# EAGLE design 6309 CPU Card v2 (EAGLE 4.16)
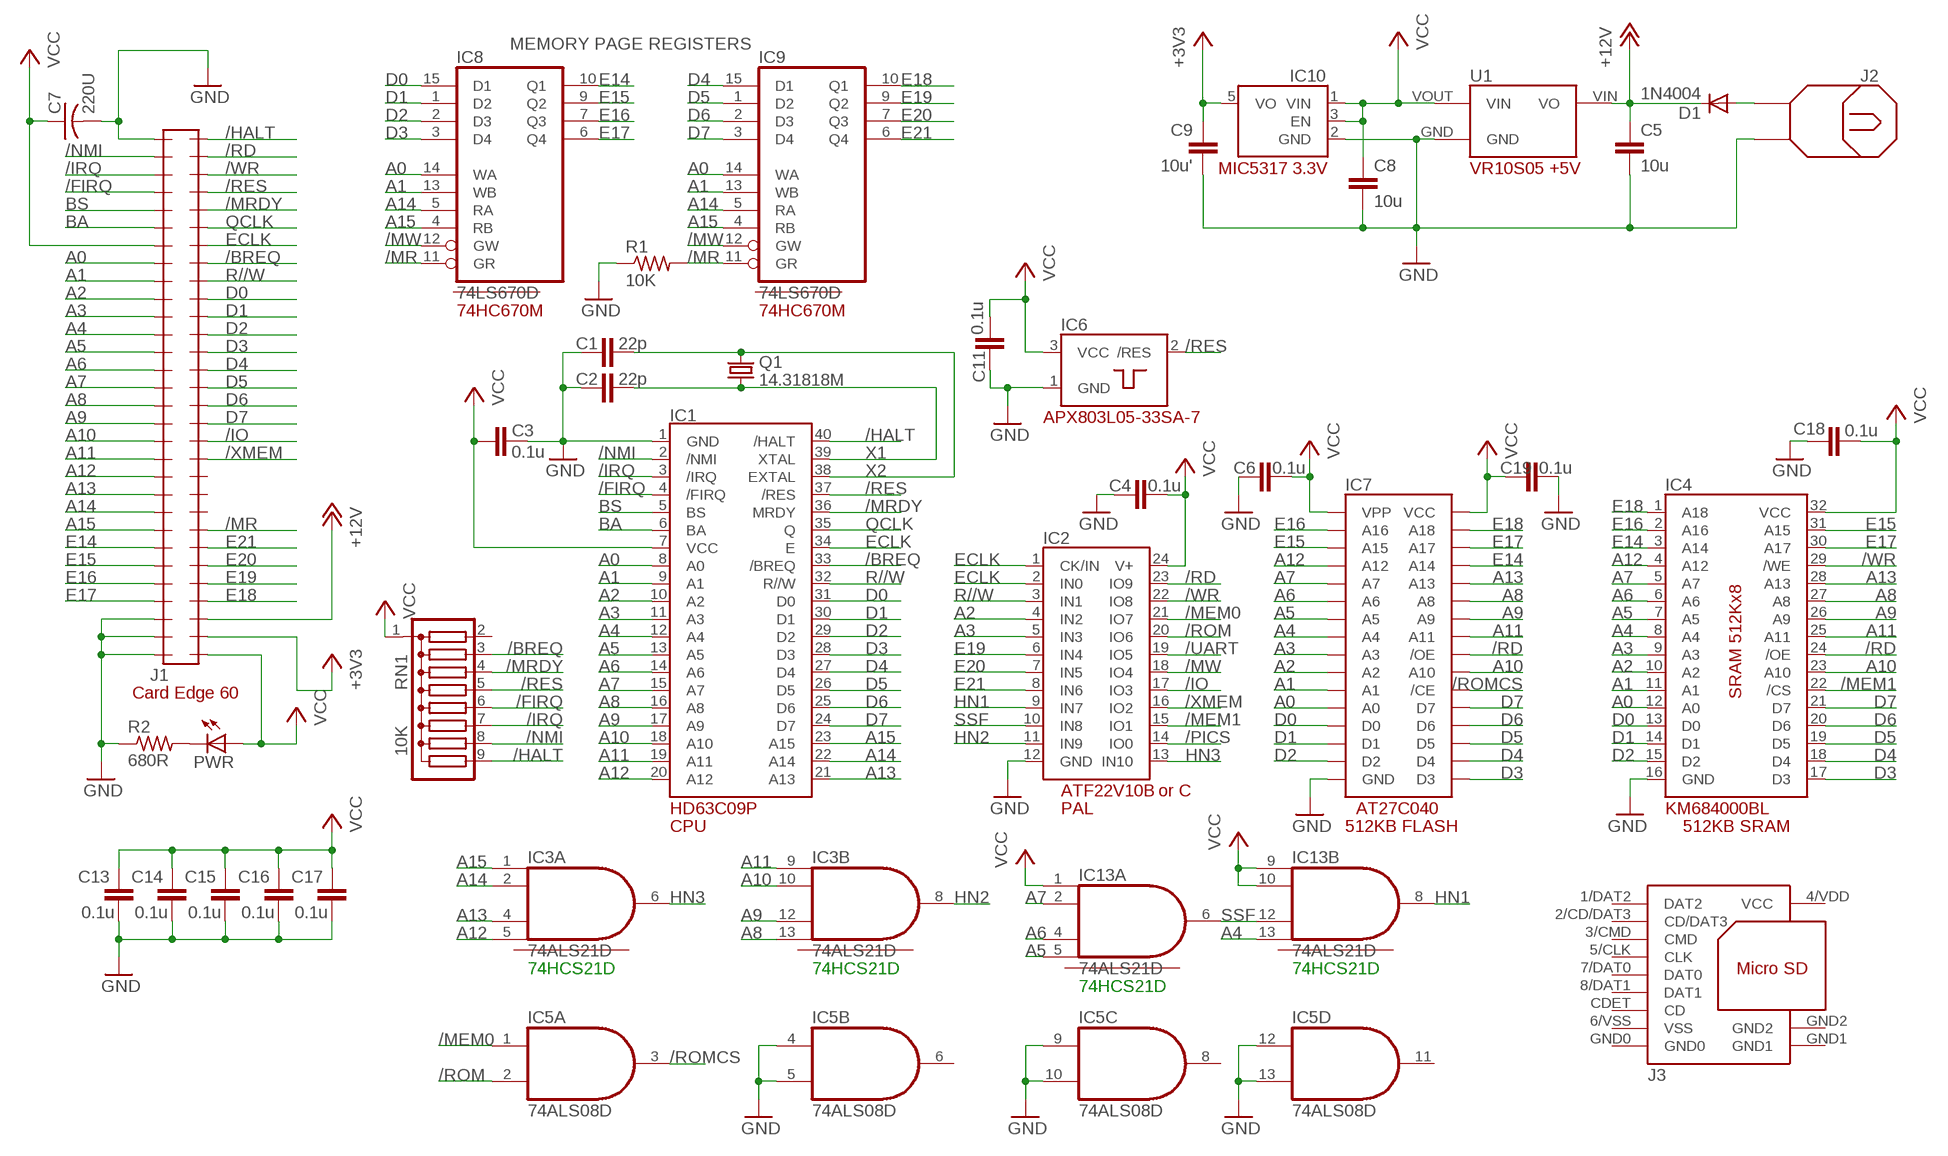
[diagram p0: schematic, sheet 1]

## Parts
C1  22p  C-EUC0603  [C0603]
C2  22p  C-EUC0603  [C0603]
C3  0.1u  C-EUC0603  [C0603]
C4  0.1u  C-EUC0603  [C0603]
C5  10u  C-EUC0805  [C0805]
C6  0.1u  C-EUC0603  [C0603]
C7  220U  C-US025-050X050  [C025-050X050]
C8  10u  C-EUC0805  [C0805]
C9  10u'  C-EUC0805  [C0805]
C11  0.1u  C-EUC0603  [C0603]
C13  0.1u  C-EUC0603  [C0603]
C14  0.1u  C-EUC0603  [C0603]
C15  0.1u  C-EUC0603  [C0603]
C16  0.1u  C-EUC0603  [C0603]
C17  0.1u  C-EUC0603  [C0603]
C18  0.1u  C-EUC0603  [C0603]
C19  0.1u  C-EUC0603  [C0603]
D1  1N4004  [DO41-10]
IC1  HD63C09P  [DIL40]
IC2  PLD_ATF22V10B  [DIL24-3]
IC3  74ALS21D  [SO14]
IC4  SRAM_512KX8_KM684000BL  [DIL32]
IC5  74ALS08D  [SO14]
IC6  POR_APX803L05-33SA-7  [SOT23]
IC7  FLASH_512KB_AT27C040  [DIL32]
IC8  74LS670D  [SO16]
IC9  74LS670D  [SO16]
IC10  MIC5317_3.3V  [SOT23-5]
IC13  74ALS21D  [SO14]
J1  CARDEDGE_2.54_60POS  CARDEDGE_2.54_60POSEDGE  [CARDEDGE_2.54_60POS]
J2  DC_BARREL_JACK  [DC_BARREL_JACK]
J3  MICROSD_AMPHENOL_GTFP084328  [MICROSD_AMPHENOL_GTFP08432B1HR]
PWR  LED3MM  [LED3MM]
Q1  14.31818M  CRYSTALHC49S  [HC49/S]
R1  10K  R-US_R0603  [R0603]
R2  680R  R-US_R0603  [R0603]
RN1  10K  G08R  [SIL9]
U1  VREG_5V_VR10S05  [VREG_5V_CP_POWER_VR10S05]

## Nets
+3V3 [supply]: C9.1 IC10.5(VO) J1.32
+12V [supply]: C5.1 D1.C J1.33 U1.VIN(VO)
/BREQ: IC1.33(/BREQ) J1.53 RN1.3
/FIRQ: IC1.4(/FIRQ) J1.4 RN1.6
/HALT: IC1.40(/HALT) J1.60 RN1.9
/IO: IC2.17(IO3) J1.43
/IRQ: IC1.3(/IRQ) J1.3 RN1.7
/MEM0: IC2.21(IO7) IC5.1(A:I0)
/MEM1: IC2.15(IO1) IC4.22(/CS)
/MR: IC8.11(GR) IC9.11(GR) J1.38 R1.2
/MRDY: IC1.36(MRDY) J1.56 RN1.4
/MW: IC2.18(IO4) IC8.12(GW) IC9.12(GW)
/NMI: IC1.2(/NMI) J1.2 RN1.8
/PICS: IC2.14(IO0)
/RD: IC2.23(IO9) IC4.24(/OE) IC7.24(/OE) J1.59
/RES: IC1.37(/RES) IC6.2(/RES) J1.57 RN1.5
/ROM: IC2.20(IO6) IC5.2(A:I1)
/ROMCS: IC5.3(A:O) IC7.22(/CE)
/UART: IC2.19(IO5)
/WR: IC2.22(IO8) IC4.29(/WE) J1.58
/XMEM: IC2.16(IO2) J1.42
A0: IC1.8(A0) IC4.12(A0) IC7.12(A0) IC8.14(WA) IC9.14(WA) J1.8
A1: IC1.9(A1) IC4.11(A1) IC7.11(A1) IC8.13(WB) IC9.13(WB) J1.9
A2: IC1.10(A2) IC2.4(IN2) IC4.10(A2) IC7.10(A2) J1.10
A3: IC1.11(A3) IC2.5(IN3) IC4.9(A3) IC7.9(A3) J1.11
A4: IC1.12(A4) IC4.8(A4) IC7.8(A4) IC13.13(B:I3) J1.12
A5: IC1.13(A5) IC4.7(A5) IC7.7(A5) IC13.5(A:I3) J1.13
A6: IC1.14(A6) IC4.6(A6) IC7.6(A6) IC13.4(A:I2) J1.14
A7: IC1.15(A7) IC4.5(A7) IC7.5(A7) IC13.2(A:I1) J1.15
A8: IC1.16(A8) IC3.13(B:I3) IC4.27(A8) IC7.27(A8) J1.16
A9: IC1.17(A9) IC3.12(B:I2) IC4.26(A9) IC7.26(A9) J1.17
A10: IC1.18(A10) IC3.10(B:I1) IC4.23(A10) IC7.23(A10) J1.18
A11: IC1.19(A11) IC3.9(B:I0) IC4.25(A11) IC7.25(A11) J1.19
A12: IC1.20(A12) IC3.5(A:I3) IC4.4(A12) IC7.4(A12) J1.20
A13: IC1.21(A13) IC3.4(A:I2) IC4.28(A13) IC7.28(A13) J1.21
A14: IC1.22(A14) IC3.2(A:I1) IC8.5(RA) IC9.5(RA) J1.22
A15: IC1.23(A15) IC3.1(A:I0) IC8.4(RB) IC9.4(RB) J1.23
BA: IC1.6(BA) J1.6
BS: IC1.5(BS) J1.5
D0: IC1.31(D0) IC4.13(D0) IC7.13(D0) IC8.15(D1) J1.51
D1: IC1.30(D1) IC4.14(D1) IC7.14(D1) IC8.1(D2) J1.50
D2: IC1.29(D2) IC4.15(D2) IC7.15(D2) IC8.2(D3) J1.49
D3: IC1.28(D3) IC4.17(D3) IC7.17(D3) IC8.3(D4) J1.48
D4: IC1.27(D4) IC4.18(D4) IC7.18(D4) IC9.15(D1) J1.47
D5: IC1.26(D5) IC4.19(D5) IC7.19(D5) IC9.1(D2) J1.46
D6: IC1.25(D6) IC4.20(D6) IC7.20(D6) IC9.2(D3) J1.45
D7: IC1.24(D7) IC4.21(D7) IC7.21(D7) IC9.3(D4) J1.44
E14: IC4.3(A14) IC7.29(A14) IC8.10(Q1) J1.24
E15: IC4.31(A15) IC7.3(A15) IC8.9(Q2) J1.25
E16: IC4.2(A16) IC7.2(A16) IC8.7(Q3) J1.26
E17: IC4.30(A17) IC7.30(A17) IC8.6(Q4) J1.27
E18: IC4.1(A18) IC7.31(A18) IC9.10(Q1) J1.34
E19: IC2.6(IN4) IC9.9(Q2) J1.35
E20: IC2.7(IN5) IC9.7(Q3) J1.36
E21: IC2.8(IN6) IC9.6(Q4) J1.37
ECLK: IC1.34(E) IC2.1(CK/IN) IC2.2(IN0) J1.54
GND [supply]: C1.1 C2.1 C3.2 C4.1 C5.2 C6.1 C7.2 C8.2 C9.2 C11.2 C13.2 C14.2 C15.2 C16.2 C17.2 C18.1 C19.2 IC1.1(GND) IC2.12(GND) IC4.16(GND) IC5.4(B:I0) IC5.5(B:I1) IC5.9(C:I0) IC5.10(C:I1) IC5.12(D:I0) IC5.13(D:I1) IC6.1(GND) IC7.16(GND) IC10.2(GND) J1.1 J1.28 J1.29 J1.30 J2.- R1.1 R2.1 U1.GND
HN1: IC2.9(IN7) IC13.8(B:O)
HN2: IC2.11(IN9) IC3.8(B:O)
HN3: IC2.13(IN10) IC3.6(A:O)
N$1 [supply]: D1.A J2.+
N$2: PWR.K(C) R2.2
QCLK: IC1.35(Q) J1.55
R//W: IC1.32(R//W) IC2.3(IN1) J1.52
SSF: IC2.10(IN8) IC13.6(A:O) IC13.12(B:I2)
VCC [supply]: C3.1 C4.2 C6.2 C7.1 C8.1 C11.1 C13.1 C14.1 C15.1 C16.1 C17.1 C18.2 C19.1 IC1.7(VCC) IC2.24(V+) IC4.32(VCC) IC6.3(VCC) IC7.1(VPP) IC7.32(VCC) IC10.1(VIN) IC10.3(EN) IC13.1(A:I0) IC13.9(B:I0) IC13.10(B:I1) J1.7 J1.31 PWR.A RN1.1 U1.VOUT(VIN)
X1: C2.2 IC1.39(XTAL) Q1.1
X2: C1.2 IC1.38(EXTAL) Q1.2
Unconnected: IC5.6(B:O) IC5.8(C:O) IC5.11(D:O) J1.39 J1.40 J1.41 J3.1/DAT2(DAT2) J3.2/CD/DAT3(CD/DAT3) J3.3/CMD(CMD) J3.4/VDD(VCC) J3.5/CLK(CLK) J3.6/VSS(VSS) J3.7/DAT0(DAT0) J3.8/DAT1(DAT1) J3.CDET(CD) J3.GND0 J3.GND1 J3.GND2 RN1.2

## Notes on the sheet
- MEMORY PAGE REGISTERS
- 74HC670M | 74HC670M
- or C
- PAL
- CPU | 512KB FLASH | 512KB SRAM
- 74HCS21D | 74HCS21D | 74HCS21D
- 74HCS21D

## Power pins joined to a net without a drawn wire
GND: IC3.7(P:GND) IC5.7(P:GND) IC8.8(GND) IC9.8(GND) IC13.7(P:GND)
VCC: IC3.14(P:VCC) IC5.14(P:VCC) IC8.16(VCC) IC9.16(VCC) IC13.14(P:VCC)

## Library data of the parts
C1-C6 C8 C9 C11 C13-C19 = rcl:C-EU: CAPACITOR, European symbol
C7 = rcl:C-US: CAPACITOR, American symbol
D1 = diode:1N4004: DIODE general purpose rectifier, 1 A
IC1 = 07-Retrocomputing:HD63C09P
IC2 = 07-Retrocomputing:PLD_ATF22V10B
IC3 IC13 = 74xx-us:74*21: Dual 4-input AND gate
IC4 = 07-Retrocomputing:SRAM_512KX8_KM684000BL
IC5 = 74xx-us:74*08: Quad 2-input AND gate
IC6 = 07-Retrocomputing:POR_APX803L05-33SA-7
IC7 = 07-Retrocomputing:FLASH_512KB_AT27C040
IC8 IC9 = 74xx-us:74*670: 4 by 4 REGISTER FILES, 3-state
IC10 = 07-Retrocomputing:MIC5317_3.3V
J1 = 07-Retrocomputing:CARDEDGE_2.54_60POS
J2 = 01-hacker-daw:DC_BARREL_JACK
J3 = 07-Retrocomputing:MICROSD_AMPHENOL_GTFP084328
PWR = led:LED: LED OSRAM: - CHIPLED LG R971, LG N971, LY N971, LG Q971, LY Q971, LO R971, LY R971 LH N974, LH R974 LS Q976, LO Q976, LY Q976 LO Q996 - Hyper CHIPLED LW Q18S LB Q993, LB Q99A, LB R99A - SideLED LS A670, LO A670, LY A670, LG A670, LP A670 LB A673, LV A673, LT A673, LW A673 LH A674 LY A675 LS A676, LA A676, LO A676, LY A676, LW A676 LS A679, LY A679, LG A679 - Hyper Micro SIDELED® LS Y876, LA Y876, LO Y876, LY Y876 LT Y87S - SmartLED LW L88C, LW L88S LB L89C, LB L89S, LG L890 LS L89K, LO L89K, LY L89K LS L896, LA L896, LO L896, LY L896 - TOPLED LS T670, LO T670, LY T670, LG T670, LP T670 LSG T670, LSP T670, LSY T670, LOP T670, LYG T670 LG T671, LOG T671, LSG T671 LB T673, LV T673, LT T673, LW T673 LH T674 LS T676, LA T676, LO T676, LY T676, LB T676, LH T676, LSB T676, LW T676 LB T67C, LV T67C, LT T67C, LS T67K, LO T67K, LY T67K, LW E67C LS E67B, LA E67B, LO E67B, LY E67B, LB E67C, LV E67C, LT E67C LW T67C LS T679, LY T679, LG T679 LS T770, LO T770, LY T770, LG T770, LP T770 LB T773, LV T773, LT T773, LW T773 LH T774 LS E675, LA E675, LY E675, LS T675 LS T776, LA T776, LO T776, LY T776, LB T776 LHGB T686 LT T68C, LB T68C - Hyper Mini TOPLED® LB M676 - Mini TOPLED Santana® LG M470 LS M47K, LO M47K, LY M47K Source: http://www.osram.convergy.de - LUMILED® LXK2-PW12-R00, LXK2-PW12-S00, LXK2-PW14-U00, LXK2-PW14-V00 LXK2-PM12-R00, LXK2-PM12-S00, LXK2-PM14-U00 LXK2-PE12-Q00, LXK2-PE12-R00, LXK2-PE12-S00, LXK2-PE14-T00, LXK2-PE14-U00 LXK2-PB12-K00, LXK2-PB12-L00, LXK2-PB12-M00, LXK2-PB14-N00, LXK2-PB14-P00, LXK2-PB14-Q00 LXK2-PR12-L00, LXK2-PR12-M00, LXK2-PR14-Q00, LXK2-PR14-R00 LXK2-PD12-Q00, LXK2-PD12-R00, LXK2-PD12-S00 LXK2-PH12-R00, LXK2-PH12-S00 LXK2-PL12-P00, LXK2-PL12-Q00, LXK2-PL12-R00 Source: www.luxeon.com
Q1 = crystal:CRYSTAL: CRYSTAL
R1 R2 = rcl:R-US_: RESISTOR, American symbol
RN1 = resistor-sil:G08R: SIL RESISTOR
U1 = 07-Retrocomputing:VREG_5V_VR10S05

## Net classes
0 default: width 0.203 mm, drill 0.203 mm, clearance 0.254 mm
1 supply: width 0.61 mm, drill 0.203 mm, clearance 0.305 mm

## Board
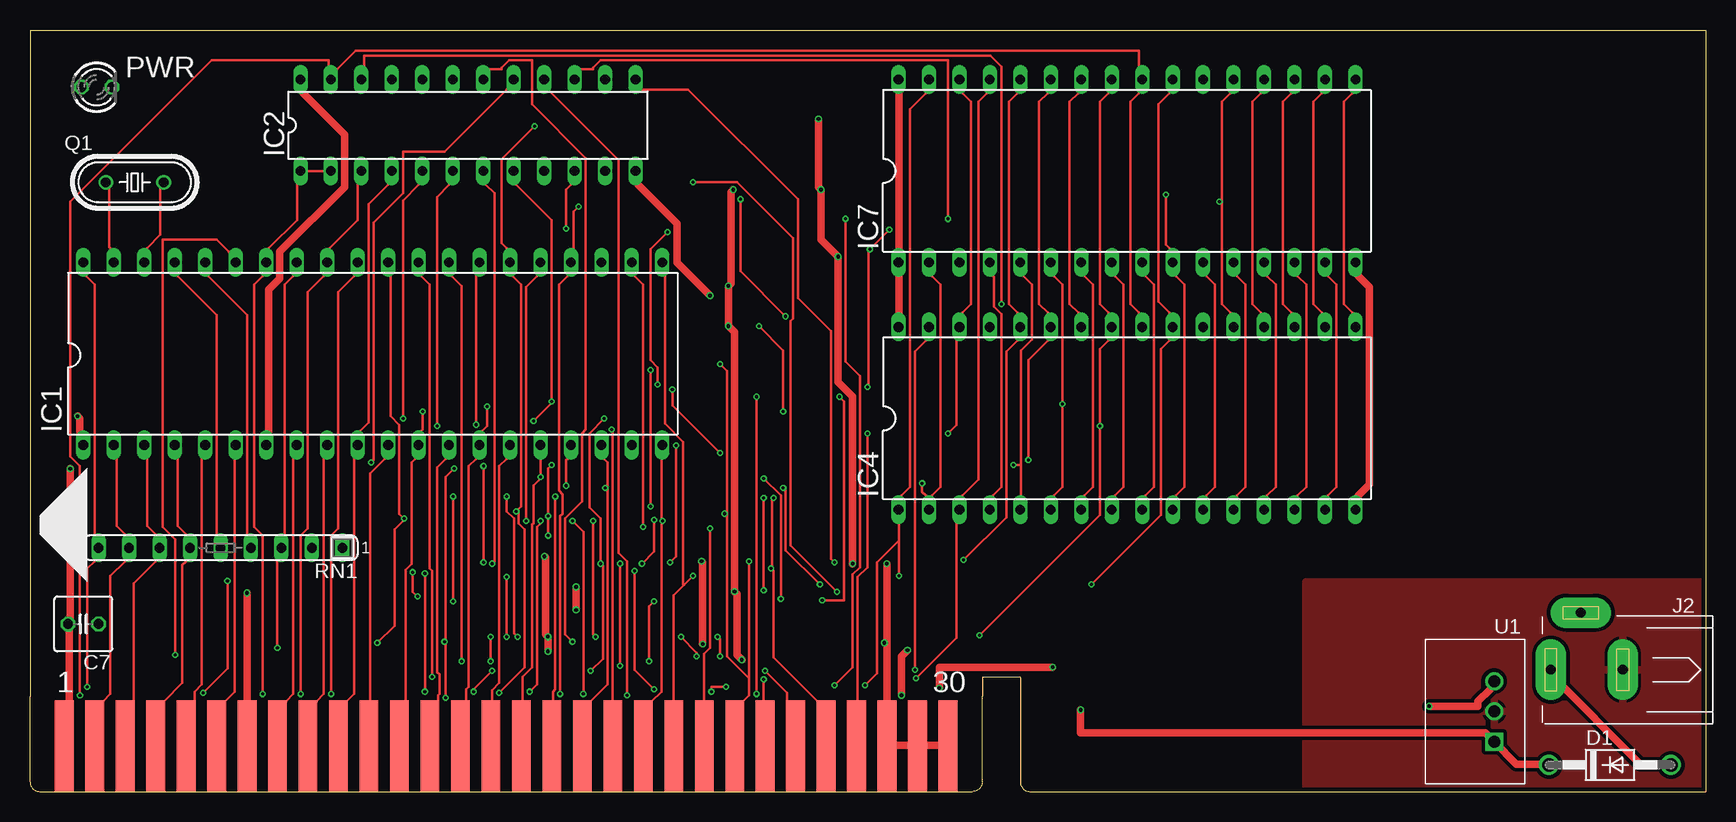
[diagram p1: board, top side]
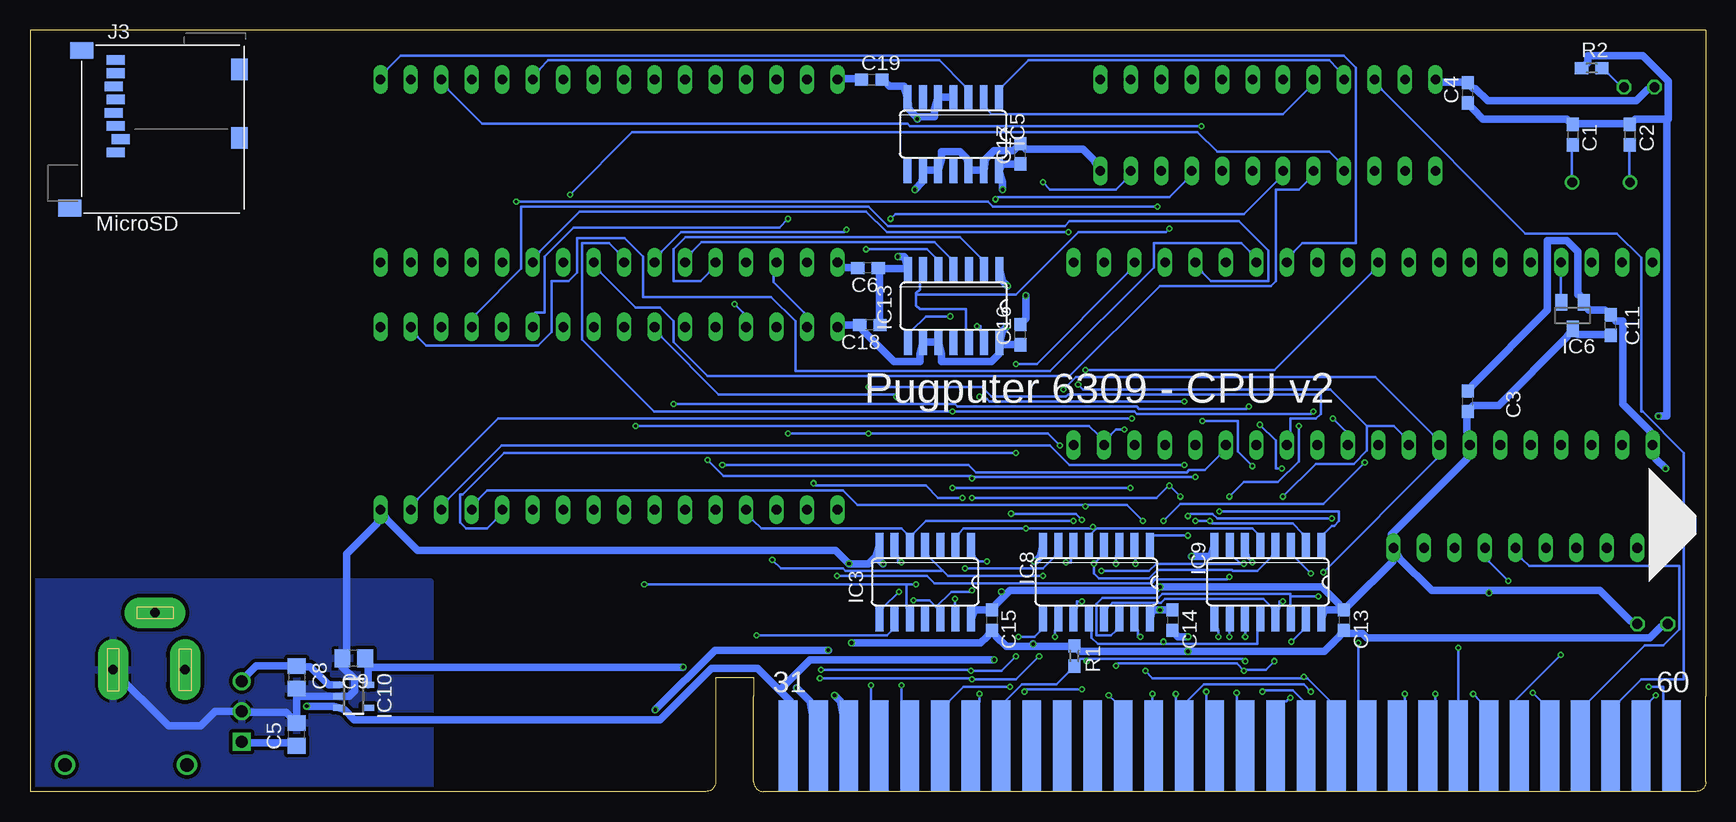
[diagram p2: board, bottom side, seen from below]

Size 139.7 x 63.5 mm. Coordinates in mm from the lower left corner, seen from the top.
Outline: 0,7.94 0,63.5 139.7,63.5 139.7,0 83.34,0 arc-90 82.55,0.79 82.55,9.53 79.38,9.53 79.38,7.94
Copper layers (1*16): Top 0.0356mm / dielectric 1.6mm / Bottom 0.0356mm
Design rules "oshpark-2layer": minimum track width 6mil, minimum drill 10mil, track to track 6mil, track to pad 6mil, pad to pad 6mil, via to via 6mil, smd to smd 6mil, copper to edge 15mil, drill to drill 6mil, minimum pad ring 5mil, minimum via ring 5mil, stop-mask expansion 2.5mil, vias tented up to drill 0mil, thermal gap 10mil

### Footprints (pad centres in the part's own frame; a part is rotated, then mirrored left to right if it is on the bottom)
C0603 = smd 1.1 x 1: 1 -0.85,0; 2 0.85,0
C0805 = smd 1.3 x 1.5: 1 -0.95,0; 2 0.95,0
C025-050X050 = drill 0.813 octagon: 1 -1.27,0; 2 1.27,0
DO41-10 = drill 1.118 round: A 5.08,0; C -5.08,0
DIL40 = drill 0.813 long: 1 -24.13,-7.62; 2 -21.59,-7.62; 3 -19.05,-7.62; 4 -16.51,-7.62; 5 -13.97,-7.62; 6 -11.43,-7.62; 7 -8.89,-7.62; 8 -6.35,-7.62; 9 -3.81,-7.62; 10 -1.27,-7.62; 11 1.27,-7.62; 12 3.81,-7.62; 13 6.35,-7.62; 14 8.89,-7.62; 15 11.43,-7.62; 16 13.97,-7.62; 17 16.51,-7.62; 18 19.05,-7.62; 19 21.59,-7.62; 20 24.13,-7.62; 21 24.13,7.62; 22 21.59,7.62; 23 19.05,7.62; 24 16.51,7.62; 25 13.97,7.62; 26 11.43,7.62; 27 8.89,7.62; 28 6.35,7.62; 29 3.81,7.62; 30 1.27,7.62; 31 -1.27,7.62; 32 -3.81,7.62; 33 -6.35,7.62; 34 -8.89,7.62; 35 -11.43,7.62; 36 -13.97,7.62; 37 -16.51,7.62; 38 -19.05,7.62; 39 -21.59,7.62; 40 -24.13,7.62
DIL24-3 = drill 0.813 long: 1 -13.97,-3.81; 2 -11.43,-3.81; 3 -8.89,-3.81; 4 -6.35,-3.81; 5 -3.81,-3.81; 6 -1.27,-3.81; 7 1.27,-3.81; 8 3.81,-3.81; 9 6.35,-3.81; 10 8.89,-3.81; 11 11.43,-3.81; 12 13.97,-3.81; 13 13.97,3.81; 14 11.43,3.81; 15 8.89,3.81; 16 6.35,3.81; 17 3.81,3.81; 18 1.27,3.81; 19 -1.27,3.81; 20 -3.81,3.81; 21 -6.35,3.81; 22 -8.89,3.81; 23 -11.43,3.81; 24 -13.97,3.81
SO14 = smd 0.66 x 2.032: 1 -3.81,-3.073; 2 -2.54,-3.073; 3 -1.27,-3.073; 4 0,-3.073; 5 1.27,-3.073; 6 2.54,-3.073; 7 3.81,-3.073; 8 3.81,3.073; 9 2.54,3.073; 10 1.27,3.073; 11 0,3.073; 12 -1.27,3.073; 13 -2.54,3.073; 14 -3.81,3.073
DIL32 = drill 0.813 long: 1 -19.05,-7.62; 2 -16.51,-7.62; 3 -13.97,-7.62; 4 -11.43,-7.62; 5 -8.89,-7.62; 6 -6.35,-7.62; 7 -3.81,-7.62; 8 -1.27,-7.62; 9 1.27,-7.62; 10 3.81,-7.62; 11 6.35,-7.62; 12 8.89,-7.62; 13 11.43,-7.62; 14 13.97,-7.62; 15 16.51,-7.62; 16 19.05,-7.62; 17 19.05,7.62; 18 16.51,7.62; 19 13.97,7.62; 20 11.43,7.62; 21 8.89,7.62; 22 6.35,7.62; 23 3.81,7.62; 24 1.27,7.62; 25 -1.27,7.62; 26 -3.81,7.62; 27 -6.35,7.62; 28 -8.89,7.62; 29 -11.43,7.62; 30 -13.97,7.62; 31 -16.51,7.62; 32 -19.05,7.62
SOT23 = smd 1 x 1.4: 1 -0.95,-1.1; 2 0.95,-1.1; 3 0,1.1
SO16 = smd 0.66 x 2.032: 1 -4.445,-3.073; 2 -3.175,-3.073; 3 -1.905,-3.073; 4 -0.635,-3.073; 5 0.635,-3.073; 6 1.905,-3.073; 7 3.175,-3.073; 8 4.445,-3.073; 9 4.445,3.073; 10 3.175,3.073; 11 1.905,3.073; 12 0.635,3.073; 13 -0.635,3.073; 14 -1.905,3.073; 15 -3.175,3.073; 16 -4.445,3.073
SOT23-5 = smd 0.5 x 1: 1 -0.95,-1.2; 2 0,-1.2; 3 0.95,-1.2; 4 0.95,1.2; 5 -0.95,1.2
CARDEDGE_2.54_60POS = smd 1.556 x 7.62: 1 -36.83,3.81; 2 -34.29,3.81; 3 -31.75,3.81; 4 -29.21,3.81; 5 -26.67,3.81; 6 -24.13,3.81; 7 -21.59,3.81; 8 -19.05,3.81; 9 -16.51,3.81; 10 -13.97,3.81; 11 -11.43,3.81; 12 -8.89,3.81; 13 -6.35,3.81; 14 -3.81,3.81; 15 -1.27,3.81; 16 1.27,3.81; 17 3.81,3.81; 18 6.35,3.81; 19 8.89,3.81; 20 11.43,3.81; 21 13.97,3.81; 22 16.51,3.81; 23 19.05,3.81; 24 21.59,3.81; 25 24.13,3.81; 26 26.67,3.81; 27 29.21,3.81; 28 31.75,3.81; 29 34.29,3.81; 30 36.83,3.81 | smd 1.556 x 7.62 bottom: 31 36.83,3.81; 32 34.29,3.81; 33 31.75,3.81; 34 29.21,3.81; 35 26.67,3.81; 36 24.13,3.81; 37 21.59,3.81; 38 19.05,3.81; 39 16.51,3.81; 40 13.97,3.81; 41 11.43,3.81; 42 8.89,3.81; 43 6.35,3.81; 44 3.81,3.81; 45 1.27,3.81; 46 -1.27,3.81; 47 -3.81,3.81; 48 -6.35,3.81; 49 -8.89,3.81; 50 -11.43,3.81; 51 -13.97,3.81; 52 -16.51,3.81; 53 -19.05,3.81; 54 -21.59,3.81; 55 -24.13,3.81; 56 -26.67,3.81; 57 -29.21,3.81; 58 -31.75,3.81; 59 -34.29,3.81; 60 -36.83,3.81
DC_BARREL_JACK = drill 0.8 pad 2.54 long: + 13.5,0; - 7.5,0; SW 11,-4.75
MICROSD_AMPHENOL_GTFP08432B1HR = smd 0.8 x 1.5: 1/DAT2 1.95,-10.3; 2/CD/DAT3 0.85,-9.9; 3/CMD -0.25,-10.3; 4/VDD -1.35,-10.5; 5/CLK -2.45,-10.3; 6/VSS -3.55,-10.5; 7/DAT0 -4.65,-10.3; 8/DAT1 -5.75,-10.3 | smd 1.8 x 1.4: CDET -4.95,0; GND0 0.75,0 | smd 1.4 x 1.9: GND1 -6.55,-13.15; GND2 6.6,-14.15
LED3MM = drill 0.813 octagon: A -1.27,0; K 1.27,0
HC49/S = drill 0.813 round: 1 -2.413,0; 2 2.413,0
R0603 = smd 1.1 x 1: 1 -0.85,0; 2 0.85,0
SIL9 = drill 0.813 long: 1 -10.16,0; 2 -7.62,0; 3 -5.08,0; 4 -2.54,0; 5 0,0; 6 2.54,0; 7 5.08,0; 8 7.62,0; 9 10.16,0
VREG_5V_CP_POWER_VR10S05 = drill 1 round: GND 0,0; VOUT 2.54,0 | drill 1 square: VIN -2.54,0

### Placement (x,y rotation side)
C1  11.11,54.77 270 bottom
C2  6.35,54.77 270 bottom
C3  19.84,32.54 90 bottom
C4  19.84,58.26 90 bottom
C5  117.47,4.76 90 bottom
C6  69.85,43.66 180 bottom
C7  4.45,13.97 180 top
C8  117.47,9.53 270 bottom
C9  112.71,11.11 180 bottom
C11  7.94,38.89 90 bottom
C13  30.16,14.29 270 bottom
C14  44.45,14.29 270 bottom
C15  59.53,14.29 270 bottom
C16  57.15,38.1 90 bottom
C17  57.15,53.18 90 bottom
C18  69.69,38.89 180 bottom
C19  69.53,59.37 0 bottom
D1  131.7,2.22 0 top
IC1  28.57,36.51 0 top
IC2  36.51,55.56 0 top
IC3  65.09,17.46 180 bottom
IC4  91.44,31.11 0 top
IC5  62.74,54.8 180 bottom
IC6  11.11,39.69 180 bottom
IC7  91.44,51.75 0 top
IC8  50.8,17.46 180 bottom
IC9  36.51,17.46 180 bottom
IC10  112.71,7.94 270 bottom
IC13  62.71,40.48 180 bottom
J1  39.69,0 0 top
J2  140.27,10.16 180 top
J3  122.24,55.24 270 bottom
PWR  5.56,58.74 0 top
Q1  8.73,50.8 0 top
R1  52.64,11.3 270 bottom
R2  9.53,60.33 0 bottom
RN1  15.88,20.32 180 top
U1  122.05,6.67 90 top

### Tracks (layer width: path | path; a pad name or v marks a point on that pad's centre or on a via)
+3V3  (via drill 0.3)
  Top 0.61: v85.24,10.36 75.79,10.36 v75.79,8.64
  Bottom 0.61: IC10.5 111.51,11.04 111.51,11.05 111.57,11.11 C9.1 111.15,10.36 v85.24,10.36 | v75.79,8.64 74.68,7.52 J1.32
+12V  (via drill 0.3)
  Top 0.61: D1.C 126.62,2.29 123.89,2.29 U1.VIN 121.31,4.88 87.58,4.88 v87.58,6.81 | v73.15,11.79 72.64,11.28 v72.64,8.03
  Bottom 0.61: U1.VIN 122.05,4.06 117.73,4.06 C5.1 | v87.58,6.81 82.6,11.79 v73.15,11.79 | v72.64,8.03 72.14,7.52 J1.33
/BREQ  (via drill 0.25)
  Top 0.203: IC1.33 21.95,42.98 21.23,42.27 21.23,21.44 RN1.3 20.62,19.2 v20.62,11.99
  Bottom 0.203: v20.62,11.99 20.62,7.52 J1.53
/FIRQ
  Top 0.203: IC1.4 12.29,27.74 12.29,22.15 13.01,21.44 RN1.6 13.01,19.2 12.7,18.9 12.7,9.04 11.18,7.52 J1.4
/HALT  (via drill 0.25)
  Top 0.203: IC1.40 4.67,42.98 5.38,42.27 5.38,21.44 RN1.9 5.38,19.2 4.78,18.59 v4.78,8.74
  Bottom 0.203: v4.78,8.74 3.56,8.74 3.56,7.52 J1.60
/IO  (via drill 0.25)
  Top 0.203: v28.45,27.43 28.65,27.64 28.65,47.45 31.09,49.89 31.09,53.34 34.54,53.34 39.73,58.52 IC2.17 | v45.21,22.55 46.13,21.64 v46.13,8.13
  Bottom 0.203: v28.45,27.43 31.9,23.98 43.79,23.98 v45.21,22.55 | v46.13,8.13 46.13,7.52 J1.43
/IRQ
  Top 0.203: IC1.3 9.75,27.74 9.75,22.15 10.46,21.44 RN1.7 10.46,19.2 8.64,17.37 8.64,7.52 J1.3
/MEM0
  Bottom 0.203: IC5.1 58.62,58.83 56.49,60.96 31.39,60.96 30.68,60.25 IC2.21
/MEM1  (via drill 0.25)
  Top 0.203: v76.5,47.75 76.5,60.96 47.55,60.96 46.94,60.35 46.94,60.25 45.92,60.25 IC2.15
  Bottom 0.203: v76.5,47.75 77.22,47.04 94.39,47.04 96.83,44.6 96.83,39.93 97.54,39.93 IC4.22
/MR  (via drill 0.25)
  Top 0.203: v38.41,10.87 v38.41,12.9 | v52.02,15.85 51.61,15.44 v51.61,10.87
  Bottom 0.203: J1.38 58.42,7.52 57,8.94 54.15,8.94 53.14,9.96 R1.2 52.22,10.97 52.12,11.07 51.61,11.07 | v38.41,12.9 38.41,13.41 IC9.11 | v38.41,10.87 38.61,11.07 51.61,11.07 | v52.02,15.85 52.43,15.85 52.43,15.34 IC8.11 | 51.61,11.07 v51.61,10.87
/MRDY  (via drill 0.25)
  Top 0.203: IC1.36 14.83,42.98 18.09,39.73 18.09,21.44 RN1.4 | v14.43,8.23 16.46,10.26 v16.46,17.58
  Bottom 0.203: v14.43,8.23 13.72,7.52 J1.56 | v16.46,17.58 18.09,19.2 RN1.4
/MW  (via drill 0.25)
  Top 0.203: v45.21,12.5 44.6,13.11 44.6,22.76 46.02,24.18 46.02,29.87 46.33,30.18 46.33,52.83 41.86,57.3 41.86,60.96 39.93,60.96 39.32,60.35 39.32,60.25 38.3,60.25 IC2.18
  Bottom 0.203: 45.21,12.29 50.7,12.29 51.21,12.8 51.21,13.41 IC8.12 | 45.21,12.29 37.39,12.29 37.39,13.41 IC9.12 | 45.21,12.29 v45.21,12.5
/NMI
  Top 0.203: IC1.2 7.21,27.74 7.21,22.15 7.92,21.44 RN1.8 7.92,19.2 6.71,17.98 6.71,8.13 6.1,7.52 J1.2
/RD  (via drill 0.25)
  Top 0.203: IC4.24 92.46,39.93 91.75,40.64 91.75,57.51 92.46,58.22 IC7.24 92.46,60.55 92.46,61.77 27.13,61.77 25.6,60.25 IC2.23 24.89,60.55 24.89,60.96 15.14,60.96 3.35,49.17 3.35,27.94 4.17,27.13 v4.17,8.03
  Bottom 0.203: v4.17,8.03 4.67,7.52 J1.59
/RES
  Top 0.203: RN1.5 15.54,21.44 15.54,39.73 12.29,42.98 IC1.37
  Bottom 0.203: IC6.2 12.09,41.45 12.09,42.98 IC1.37 | J1.57 9.75,7.52 5.08,12.19 3.56,12.19 2.23,13.51 2.23,18.8 14.73,18.8 15.34,19.41 RN1.5
/ROM
  Bottom 0.203: IC5.2 59.94,56.9 59.54,56.49 35.26,56.49 33.22,58.52 IC2.20
/ROMCS
  Bottom 0.203: IC5.3 61.77,58.83 63.91,60.96 96.52,60.96 97.23,60.25 IC7.22
/WR  (via drill 0.25)
  Top 0.203: v80.97,40.64 80.97,60.45 80.06,61.37 27.84,61.37 27.84,60.55 IC2.22
  Bottom 0.203: IC2.22 27.03,58.52 15.04,46.53 7.42,46.53 5.38,44.5 5.38,31.7 5.28,31.7 1.83,28.25 1.83,9.35 5.38,9.35 7.21,7.52 J1.58 | v80.97,40.64 80.26,39.93 IC4.29
/XMEM  (via drill 0.25)
  Top 0.203: v49.78,8.03 49.78,19.2 49.07,19.91 49.07,52.63 43.28,58.42 IC2.16
  Bottom 0.203: v49.78,8.03 49.28,7.52 J1.42
A0  (via drill 0.25)
  Top 0.203: IC4.12 100.58,24.69 101.3,25.4 101.3,42.27 100.58,42.98 IC7.12 | IC1.8 21.95,27.74 21.95,8.13 21.34,7.52 J1.8 | v32.31,16.26 31.9,16.66 v31.9,18.29 | v57.51,28.25 53.54,32.21 v53.54,33.53
  Bottom 0.203: 34.65,16.26 34.65,16.46 45.31,16.46 45.62,16.15 50.29,16.15 50.8,15.65 50.8,13.01 49.58,13.01 49.17,13.41 IC8.14 | 34.65,16.26 34.65,15.34 IC9.14 | v32.31,16.26 34.65,16.26 | v31.9,18.29 22.45,27.74 IC1.8 22.76,29.77 27.53,34.54 52.53,34.54 v53.54,33.53 | v57.51,28.25 100.18,28.25 103.63,24.79 103.83,24.79 103.83,22.45 103.33,21.95 101.6,21.95 100.89,22.66 IC4.12
A1  (via drill 0.25)
  Top 0.203: IC4.11 98.04,24.69 98.75,25.4 98.75,42.27 98.04,42.98 IC7.11 | IC1.9 24.49,27.74 24.49,8.13 23.88,7.52 J1.9 | v35.26,24.59 v35.26,15.85 | v53.14,46.63 51.71,45.21 51.71,35.97 52.32,35.36 v52.32,33.93
  Bottom 0.203: IC8.13 49.89,15.34 49.48,15.75 45.41,15.75 45.11,16.05 36.88,16.05 36.17,15.34 IC9.13 35.56,15.34 35.56,15.85 v35.26,15.85 | v35.26,24.59 32.51,27.33 29.36,27.33 28.25,28.45 28.25,30.48 | 28.25,30.48 26.01,30.48 25.3,29.77 IC1.9 | v53.14,46.63 68.28,46.63 70,48.36 93.88,48.36 97.23,45.01 IC7.11 | v52.32,33.93 51.92,33.53 31.29,33.53 28.25,30.48
A2  (via drill 0.25)
  Top 0.203: IC4.10 95.5,24.69 96.22,25.4 96.22,42.27 95.5,42.98 IC7.10 95,45.31 94.69,45.62 v94.69,49.78 | J1.10 26.42,7.52 27.03,8.13 27.03,27.74 IC1.10 27.53,30.07 28.25,30.79 28.25,48.97 29.87,50.6 IC2.4
  Bottom 0.203: v94.69,49.78 89.51,54.97 42.37,54.97 40.74,53.34 31.39,53.34 30.68,52.63 IC2.4
A3  (via drill 0.25)
  Top 0.203: IC4.9 92.96,24.69 93.67,25.4 93.67,42.27 92.96,42.98 IC7.9 | IC1.11 29.57,27.74 28.35,26.52 28.35,7.52 J1.11 | v31.09,31.09 31.09,49.28 32.41,50.6 IC2.5
  Bottom 0.203: v31.09,31.09 30.07,30.07 IC1.11 | IC7.9 92.15,43.28 89.2,40.34 87.17,40.34 86.06,39.22 86.06,37.49 83.21,34.65 53.03,34.65 45.52,42.16 36.27,42.16 35.87,42.57 35.87,50.19 33.93,50.19 33.22,50.9 IC2.5
A4  (via drill 0.25)
  Top 0.203: J1.12 31.29,7.52 31.29,18.49 31.8,19 31.8,27.43 32.11,27.74 IC1.12 32.61,30.07 32.72,30.18 v32.72,31.7 | v60.76,38.81 62.79,36.78 v62.79,31.7 | IC4.8 90.42,24.69 91.14,25.4 91.14,42.27 90.42,42.98 IC7.8
  Bottom 0.203: v60.76,38.81 60.45,38.81 60.45,38.41 IC13.13 | IC7.8 90.73,45.01 91.44,45.72 93.67,45.72 93.67,37.69 87.68,31.7 v62.79,31.7 47.65,31.7 47.45,31.5 32.92,31.5 v32.72,31.7
A5  (via drill 0.25)
  Top 0.203: IC1.13 34.65,27.74 33.93,27.03 33.93,9.96 34.14,9.75 34.14,8.13 34.04,8.03 34.04,7.52 J1.13 | v71.63,46.84 v70,45.21 69.9,45.01 69.9,33.83 v69.8,33.73 | IC4.7 87.88,24.69 88.59,25.4 88.59,42.27 87.88,42.98 IC7.7
  Bottom 0.203: v70,45.21 64.92,45.21 64.21,44.5 IC13.5 | v71.63,46.84 71.83,46.63 85.45,46.63 87.07,45.01 IC7.7 | v69.8,33.73 60.35,33.73 59.54,32.92 53.34,32.92 53.14,33.12 32.11,33.12 32.11,31.5 32.51,31.09 34.65,31.09 34.65,30.07 IC1.13
A6  (via drill 0.25)
  Top 0.203: J1.14 36.37,7.52 36.37,8.53 36.58,8.74 36.58,27.13 37.19,27.74 IC1.14 37.69,30.07 38.1,30.48 v38.1,32.11 | IC4.6 85.34,24.69 86.06,25.4 v86.06,32.31 86.06,42.27 85.34,42.98 IC7.6
  Bottom 0.203: IC13.4 62.99,44.5 64.31,45.82 83.72,45.82 84.53,45.01 IC7.6 | v38.1,32.11 38.3,31.9 47.24,31.9 47.45,32.11 62.38,32.11 62.59,32.31 v86.06,32.31
A7  (via drill 0.25)
  Top 0.203: IC1.15 39.73,27.74 39.12,27.13 39.12,9.04 38.51,8.43 38.51,7.52 J1.15 | 82.6,27.23 82.6,36.78 83.52,37.69 83.52,42.27 82.8,42.98 IC7.5 | 82.6,27.23 82.6,24.69 IC4.5 | v81.99,27.23 82.6,27.23
  Bottom 0.203: IC13.2 60.45,44.5 62.18,46.23 85.04,46.23 86.06,45.21 86.06,42.57 83.82,42.57 83.11,43.28 IC7.5 | v81.99,27.23 61.47,27.23 60.86,26.62 43.28,26.62 43.08,26.82 41.76,26.82 40.54,28.04 IC1.15
A8  (via drill 0.25)
  Top 0.203: IC7.27 84.84,58.22 84.12,57.51 84.12,40.64 84.84,39.93 IC4.27 84.84,37.59 83.21,35.97 v83.21,27.64 | v62.59,16.05 62.59,24.69 v61.16,26.11 | IC1.16 42.57,27.74 v42.57,26.21 42.47,26.01 41.96,25.5 41.96,22.35 41.86,22.25 41.86,10.36 41.05,9.55 41.05,7.52 J1.16
  Bottom 0.203: v62.59,16.05 62.59,15.34 IC3.13 | v42.57,26.21 61.06,26.21 v61.16,26.11 61.27,26.31 81.89,26.31 v83.21,27.64
A9  (via drill 0.25)
  Top 0.203: v44.7,25.5 44.7,27.64 44.81,27.74 IC1.17 | v43.79,24.59 43.79,8.53 43.59,8.33 43.59,7.52 J1.17 | v66.04,15.95 67.87,15.95 67.87,32.51 v67.46,32.92 | IC7.26 87.38,58.22 86.67,57.51 86.67,40.64 87.38,39.93 IC4.26 | v61.16,24.49 v61.16,16.76
  Bottom 0.203: v43.79,24.59 v44.7,25.5 44.91,25.4 45.82,24.49 v61.16,24.49 | 64.16,15.39 64.72,15.95 v66.04,15.95 | 64.16,15.39 64.11,15.34 IC3.12 | v67.46,32.92 67.67,33.12 82.3,33.12 87.07,37.9 IC4.26 | v61.16,16.76 61.27,16.66 62.89,16.66 64.16,15.39
A10  (via drill 0.25)
  Top 0.203: 48.16,25.3 48.16,8.94 46.74,7.52 J1.18 | 48.16,25.3 48.16,27.43 47.85,27.74 IC1.18 | v88.49,17.27 94.28,23.06 94.28,36.88 95,37.59 IC4.23 95,39.93 94.08,40.84 94.08,57.3 95,58.22 IC7.23 | 48.16,25.3 v47.95,25.3 | v62.79,25.3 62.99,25.09 62.99,20.12 v65.84,17.27
  Bottom 0.203: 66.65,17.27 66.65,15.34 IC3.10 | 66.65,17.27 v88.49,17.27 | v47.95,25.3 v62.79,25.3 | v65.84,17.27 66.65,17.27
A11  (via drill 0.25)
  Top 0.203: v48.46,30.18 48.56,30.07 48.56,7.52 J1.19 | v79.15,13.01 89.2,23.06 v89.2,30.48 89.2,36.88 89.92,37.59 IC4.25 89.92,39.93 89.2,40.64 89.2,57.51 89.92,58.22 IC7.25
  Bottom 0.203: v48.46,30.18 49.17,30.18 49.58,29.77 IC1.19 50.7,29.77 51.41,30.48 v89.2,30.48 | v79.15,13.01 68.28,13.01 67.87,13.41 IC3.9
A12  (via drill 0.25)
  Top 0.203: IC7.4 80.26,42.98 80.37,42.88 80.37,40.44 80.97,39.83 80.97,25.4 80.26,24.69 IC4.4 | 52.63,22.55 52.63,8.33 51.82,7.52 J1.20 | 52.63,22.55 52.63,27.74 IC1.20 | 52.63,22.55 v52.73,22.55
  Bottom 0.203: IC4.4 79.45,22.66 78.74,21.95 67.06,21.95 66.65,21.54 IC3.5 66.04,21.54 65.02,22.55 v52.73,22.55
A13  (via drill 0.25)
  Top 0.203: IC7.28 82.3,58.22 81.58,57.51 81.58,40.64 82.3,39.93 IC4.28 82.3,37.59 81.38,36.68 81.38,22.86 v77.83,19.3 | 54.51,17.22 53.65,16.36 53.65,7.52 J1.21 | 54.51,17.22 v55.27,17.98 | IC1.21 52.93,42.98 52.93,30.68 54.46,29.16 54.46,17.27 54.51,17.22
  Bottom 0.203: 63.65,18.44 63.2,17.98 v55.27,17.98 | 63.65,18.44 64.82,19.61 IC3.4 | v77.83,19.3 77.11,18.59 71.93,18.59 71.73,18.39 63.7,18.39 63.65,18.44
A14  (via drill 0.25)
  Top 0.203: v51.1,22.05 51.1,42.27 50.39,42.98 IC1.22 | v56.69,21.95 56.69,11.99 56.19,11.48 56.19,7.52 J1.22
  Bottom 0.203: 50.85,21.89 51.21,21.54 IC8.5 | 50.85,21.89 50.8,21.95 37.8,21.95 37.39,21.54 IC9.5 | 51.1,21.95 50.9,21.95 50.85,21.89 | 51.1,21.95 v56.69,21.95 61.87,21.95 62.28,21.54 IC3.2 | 51.1,21.95 v51.1,22.05
A15  (via drill 0.25)
  Top 0.203: 59.94,9.45 59.94,8.03 59.44,7.52 J1.23 | 59.94,9.45 v59.94,19.2 | v57.51,35.66 58.12,35.05 58.12,23.16 | 58.12,23.16 58.12,11.28 59.94,9.45 | v51,19 52.02,20.02 v52.02,22.66 | v57.91,23.16 58.12,23.16
  Bottom 0.203: IC9.4 36.17,19.61 37.39,18.39 39.42,18.39 39.52,18.49 45.72,18.49 46.43,17.78 50.6,17.78 51,18.19 v51,19 51,19.2 50.8,19.2 50.39,19.61 IC8.4 | v59.94,19.2 60.55,19.2 60.96,19.61 IC3.1 | v57.51,35.66 55.78,35.66 48.16,43.28 IC1.23 | v52.02,22.66 52.53,23.16 v57.91,23.16
BA
  Top 0.203: IC1.6 17.07,27.74 17.07,8.33 16.26,7.52 J1.6
BS
  Top 0.203: IC1.5 14.33,27.74 14.33,8.94 13.72,8.33 13.72,7.52 J1.5
D0  (via drill 0.25)
  Top 0.203: v25.09,8.13 25.09,21.34 25.7,21.95 25.7,41.66 27.03,42.98 IC1.31 | v47.14,12.9 46.94,13.11 v46.94,22.55 | IC7.13 103.12,42.98 103.83,42.27 103.83,25.4 103.12,24.69 IC4.13 | v51.71,35.15 v51.71,23.77
  Bottom 0.203: v25.09,8.13 25.09,7.52 J1.51 | v47.14,12.9 47.35,12.9 47.35,13.41 IC8.15 | v46.94,22.55 48.26,23.88 51.71,23.88 | 51.71,23.88 70.71,23.88 71.93,25.09 101.6,25.09 102.31,24.38 IC4.13 | v51.71,35.15 35.97,35.15 27.84,43.28 IC1.31 | v51.71,23.77 51.71,23.88
D1  (via drill 0.25)
  Top 0.203: IC4.14 105.66,24.69 106.38,25.4 106.38,42.27 105.66,42.98 IC7.14 | v43.18,21.34 v43.18,22.96 43.18,26.92 v43.48,27.23 | IC1.30 30.07,42.98 30.07,31.29 30.79,30.58 30.79,23.16 v31.19,22.76 31.09,22.55 30.38,21.84 30.38,13.82 v28.96,12.39
  Bottom 0.203: v43.18,21.34 46.13,21.34 IC8.1 | v43.18,22.96 42.98,23.16 41.15,23.16 40.74,22.76 v31.19,22.76 | v28.96,12.39 28.96,7.52 J1.50 | v43.48,27.23 53.03,27.23 54.66,28.85 100.38,28.85 104.85,24.38 IC4.14
D2  (via drill 0.25)
  Top 0.203: IC4.15 108.2,24.69 108.92,25.4 108.92,42.27 108.2,42.98 IC7.15 | v46.74,10.06 47.75,11.07 47.75,18.8 v47.55,19 47.55,22.76 46.63,23.67 46.63,29.87 v47.85,31.09 | v33.53,9.55 33.53,18.39 33.33,18.59 33.33,42.27 32.61,42.98 IC1.29
  Bottom 0.203: v47.55,19 47.55,19.61 IC8.2 | v46.74,10.06 46.13,9.45 33.53,9.45 | 33.53,9.45 33.22,9.45 31.29,7.52 J1.49 | 33.53,9.45 v33.53,9.55 | v47.85,31.09 100.69,31.09 107.39,24.38 IC4.15
D3  (via drill 0.25)
  Top 0.203: IC4.17 110.24,39.93 109.53,40.64 109.53,57.51 110.24,58.22 IC7.17 | v49.17,10.46 v49.17,19 | v38.51,10.06 36.98,8.53 v36.98,8.33 | v35.97,10.87 35.97,42.16 35.15,42.98 IC1.28
  Bottom 0.203: v49.17,19 49.17,19.61 IC8.3 | v49.17,10.46 48.97,10.67 39.12,10.67 v38.51,10.06 38.3,10.16 36.68,10.16 v35.97,10.87 | v36.98,8.33 36.88,8.43 34.44,8.43 33.53,7.52 J1.48 | IC7.17 109.93,60.25 108.81,61.37 30.18,61.37 29.16,60.35 29.16,45.72 33.63,45.72 34.34,45.01 IC1.28
D4  (via drill 0.25)
  Top 0.203: IC4.18 107.7,39.93 106.98,40.64 106.98,57.51 107.7,58.22 IC7.18 | v34.65,7.82 34.65,12.39 v34.54,12.5 34.65,12.7 34.65,26.21 v35.36,26.92 | v37.19,30.58 37.19,42.98 IC1.27
  Bottom 0.203: v34.54,12.5 33.63,13.41 IC9.15 | v34.65,7.82 34.95,7.52 35.15,7.52 J1.47 | v37.19,30.58 35.87,29.26 35.87,26.92 v35.36,26.92 | IC4.18 107.39,37.9 106.68,37.19 97.33,37.19 96.22,38.3 96.22,42.57 94.79,42.57 94.08,43.28 94.08,46.13 90.12,46.13 88.59,44.6 88.59,41.25 77.93,41.25 75.89,39.22 75.89,35.05 54.66,35.05 46.02,43.69 46.02,45.72 38.71,45.72 38,45.01 IC1.27
D5  (via drill 0.25)
  Top 0.203: IC4.19 105.16,39.93 104.44,40.64 104.44,57.51 105.16,58.22 IC7.19 | v39.12,8.23 41.25,10.36 41.25,21.84 40.74,22.35 40.74,23.27 v40.54,23.37 40.95,23.77 40.95,42.27 40.23,42.98 IC1.26 39.73,45.31 39.32,45.72 39.32,52.73 v42.06,55.47
  Bottom 0.203: v40.54,23.37 30.58,23.37 30.58,22.55 30.99,22.15 31.19,22.15 31.8,21.54 IC9.1 | v39.12,8.23 39.12,7.52 J1.46 | v42.06,55.47 66.34,55.47 66.55,55.68 102.01,55.68 104.85,58.52 IC7.19
D6  (via drill 0.25)
  Top 0.203: IC4.20 102.62,39.93 101.91,40.64 101.91,57.51 102.62,58.22 IC7.20 | v41.35,22.55 41.35,42.06 42.27,42.98 IC1.25 | v41.66,8.33 42.27,8.94 42.27,22.05 42.57,22.35 v42.57,22.55
  Bottom 0.203: IC9.2 33.63,21.54 34.44,22.35 41.15,22.35 v41.35,22.55 v42.57,22.55 | v41.66,8.33 41.66,7.52 J1.45 | IC4.20 102.51,39.83 98.75,43.59 98.75,48.77 69.8,48.77 68.17,47.14 53.44,47.14 53.03,47.55 38.91,47.55 36.47,45.11 36.47,42.57 41.25,42.57 41.96,43.28 IC1.25
D7  (via drill 0.25)
  Top 0.203: 99.36,49.17 99.36,57.51 100.08,58.22 IC7.21 | 99.36,49.17 99.36,40.64 100.08,39.93 IC4.21 | v32.92,8.33 v32.92,18.19 | v44.2,8.13 44.2,22.96 44.4,23.16 44.4,24.79 44.09,25.09 44.09,42.27 44.81,42.98 IC1.24 45.31,45.31 45.31,48.36 v45.72,48.77 | v99.16,49.17 99.36,49.17
  Bottom 0.203: v32.92,18.19 34.34,19.61 IC9.3 | v32.92,8.33 33.53,8.94 41.86,8.94 43.28,7.52 J1.44 44.2,7.52 v44.2,8.13 | v99.16,49.17 59.84,49.17 59.44,48.77 v45.72,48.77
E14  (via drill 0.25)
  Top 0.203: v54.25,12.9 55.58,11.58 v55.58,11.28 | v61.16,9.35 61.16,7.52 J1.24 | IC7.29 79.76,58.22 79.05,57.51 79.05,26.01 77.72,24.69 IC4.3 77.22,22.35 77.22,12.8 v73.86,9.45
  Bottom 0.203: v54.25,12.9 54.25,13.41 IC8.10 | v55.58,11.28 57.51,9.35 v61.16,9.35 61.37,9.45 v73.86,9.45
E15  (via drill 0.25)
  Top 0.203: v57.3,12.9 57.51,12.7 v57.51,11.28 | v61.27,10.06 63.09,8.23 63.09,7.52 J1.25 | v73.76,10.16 73.76,36.68 74.68,37.59 IC4.31
  Bottom 0.203: IC4.31 75.18,39.93 77.72,42.47 77.72,42.98 IC7.3 | v57.3,12.9 55.98,12.9 55.47,13.41 IC8.9 | v57.51,11.28 58.73,10.06 v61.27,10.06 61.47,10.16 v73.76,10.16
E16  (via drill 0.25)
  Top 0.203: IC7.2 75.18,42.98 75.89,42.27 75.89,25.4 75.18,24.69 IC4.2 74.68,24.69 74.37,24.99 v74.37,25.7 | J1.26 65.63,7.52 61.98,11.18 61.98,18.39 v61.77,18.59 61.87,18.8 61.87,24.38 v61.98,24.49
  Bottom 0.203: v61.77,18.59 55.27,18.59 54.25,19.61 IC8.7 | v74.37,25.7 74.17,25.5 65.02,25.5 64.01,24.49 v61.98,24.49
E17  (via drill 0.25)
  Top 0.203: v53.34,19.1 53.85,19.61 v53.85,28.85 | v76.5,29.87 77.22,30.58 77.22,37.59 IC4.30 77.72,39.93 78.44,40.64 78.44,57.51 77.72,58.22 IC7.30 | v69.8,29.87 69.8,18.69 68.99,17.88 68.99,7.52 J1.27
  Bottom 0.203: v53.34,19.1 52.93,19.1 52.93,19.61 IC8.6 | v53.85,28.85 54.86,29.87 v69.8,29.87 v76.5,29.87
E18  (via drill 0.25)
  Top 0.203: v39.73,12.9 v39.73,17.88 | 72.44,20.93 72.44,22.35 IC4.1 72.64,24.69 73.36,25.4 73.36,56.9 74.68,58.22 IC7.31 | v72.44,17.98 72.44,20.93 | v69.6,8.84 70.61,9.86 70.61,19.1 72.44,20.93
  Bottom 0.203: v39.73,12.9 39.73,13.41 IC9.10 | v39.73,17.88 39.93,17.68 45.92,17.68 46.23,17.37 64.31,17.37 64.92,17.98 v72.44,17.98 | v69.6,8.84 69.6,7.52 J1.34
E19  (via drill 0.25)
  Top 0.203: v40.64,12.9 40.34,13.21 40.34,22.76 39.73,23.37 v39.73,24.59 | v33.93,30.48 33.93,49.58 34.95,50.6 IC2.6 | v67.06,8.84 68.58,10.36 68.58,18.09 69.19,18.69 69.19,34.65 67.97,35.87 v67.97,47.75
  Bottom 0.203: v40.64,12.9 40.64,13.41 IC9.9 | v39.73,24.59 38.51,25.81 35.66,25.81 33.93,27.53 v33.93,30.48 | v67.06,8.84 67.06,7.52 J1.35 | v67.97,47.75 67.56,48.16 38.51,48.16 35.76,50.9 IC2.6
E20  (via drill 0.25)
  Top 0.203: v38.51,19 38.71,19.2 38.71,49.89 38,50.6 IC2.7 | v58.01,8.74 56.79,8.74 v56.79,8.33 | v52.02,8.53 50.39,10.16 v50.39,18.39
  Bottom 0.203: 38.86,19.05 38.81,19 v38.51,19 | 38.86,19.05 39.42,19.61 IC9.7 | v58.01,8.74 61.87,8.74 63.09,7.52 J1.36 | v56.79,8.33 56.59,8.53 v52.02,8.53 | v50.39,18.39 46.43,18.39 45.82,19 38.91,19 38.86,19.05
E21  (via drill 0.25)
  Top 0.203: v37.8,19.1 v37.8,27.13 | v41.96,30.89 43.48,32.41 v43.48,32.51 43.48,47.65 40.54,50.6 IC2.8 | v60.55,32.92 v60.55,8.13
  Bottom 0.203: v37.8,19.1 38.1,19.41 38.1,19.61 IC9.6 | v37.8,27.13 39.01,28.35 39.01,30.89 v41.96,30.89 | v60.55,8.13 60.55,7.52 J1.37 | v60.55,32.92 60.35,32.72 59.94,32.72 59.74,32.51 v43.48,32.51
ECLK  (via drill 0.25)
  Top 0.203: IC2.2 24.49,51.71 23.06,51.71 IC2.1 22.25,50.6 22.25,47.65 19.91,45.31 IC1.34 19.41,42.98 18.69,42.27 18.69,22.05 19.41,21.34 v19.41,8.13
  Bottom 0.203: v19.41,8.13 18.8,7.52 J1.54
GND  (via drill 0.3)
  Top 0.61: v3.96,31.29 4.17,31.09 4.17,30.07 IC1.1 | J1.1 3.25,7.52 3.25,13.41 C7.2 3.35,14.53 v3.35,26.92 | v43.18,11.68 v43.18,12.9 42.98,13.11 42.98,19.51 v42.88,19.61 | v55.98,19.2 56.08,19.1 v56.08,12.29 | v56.69,41.35 53.95,44.09 53.95,47.35 50.7,50.6 IC2.12 | v65.73,56.08 65.73,50.39 v65.94,50.19 65.94,46.02 v67.36,44.6 67.36,34.14 68.58,32.92 v68.58,19 | IC7.16 110.74,42.98 111.66,42.06 111.66,25.6 110.74,24.69 IC4.16 | J1.30 75.79,3.86 74.68,3.86 J1.29 73.25,3.86 72.14,3.86 J1.28 71.42,7.52 71.42,12.39 | 71.42,12.39 v71.42,19 | v71.22,12.39 71.42,12.39
  Bottom 0.61: 117.47,8.64 C8.2 117.47,8 | 117.47,8 C5.2 118.37,6.6 122.05,6.6 U1.GND 124.27,6.67 125.48,5.46 128.14,5.46 132.84,10.16 J2.- | 117.47,8 117.41,7.94 IC10.2 113.09,7.94 112.65,8.38 112.65,9.4 113.67,10.41 113.67,11.05 113.66,11.05 C9.2 113.28,11.79 113.28,19.81 110.74,22.35 IC4.16 109.93,22.66 107.39,20.12 72.54,20.12 v71.42,19 69.8,19 69.19,19.61 | C4.1 19.41,56.9 18.59,56.08 11.58,56.08 C1.1 10.67,55.68 6.81,55.68 C2.1 5.89,56.08 3.15,56.08 | 3.15,56.08 3.15,59.23 5.28,61.37 9.86,61.37 9.86,60.76 R2.1 | C3.2 19.41,33.93 13.21,40.13 13.21,45.92 11.58,45.92 10.67,45.01 10.67,41.45 10.57,41.45 IC6.1 9.75,40.13 8.43,40.13 C11.2 7.52,39.22 6.91,39.22 6.91,32.31 4.67,30.07 IC1.1 4.17,27.74 v3.35,26.92 | v3.96,31.29 3.25,31.29 3.25,55.88 3.15,56.08 | 56.08,12.09 58.32,12.09 59.13,12.9 C15.2 59.94,12.9 60.45,12.39 v71.22,12.39 | 56.08,12.09 53.14,12.09 R1.1 52.22,11.68 v43.18,11.68 31.8,11.68 30.58,12.9 C13.2 29.67,13.21 28.65,13.21 28.25,12.8 4.67,12.8 3.76,13.72 C7.2 | v43.18,12.9 43.99,12.9 C14.2 | v42.88,19.61 41.25,19.61 IC9.8 | v55.98,19.2 55.88,19.2 55.47,19.61 IC8.8 | 56.08,12.09 v56.08,12.29 | v56.69,41.35 56.69,39.42 C16.2 | IC5.4 62.99,57.91 63.7,57.91 IC5.5 64.31,56.9 64.31,56.29 65.73,56.29 | C19.2 68.17,58.93 68.07,58.83 66.85,58.83 IC5.7 66.45,56.9 65.84,56.29 65.73,56.29 | C18.1 68.89,39.32 68.89,43.18 C6.1 68.48,43.59 66.75,43.59 IC13.7 66.75,44.5 66.85,44.6 v67.36,44.6 | v65.94,50.19 65.33,50.8 IC5.9 65.02,51.82 64.31,51.82 IC5.10 63.7,52.73 63.7,53.34 62.18,53.34 61.57,52.73 IC5.12 61.16,51.82 60.45,51.82 IC5.13 60.05,52.73 59.33,53.44 57.71,53.44 57.61,53.54 C17.2 56.69,53.54 51.92,53.54 51,52.63 IC2.12
  Bottom 0.61: v65.73,56.08 65.73,56.29 | 69.19,19.61 IC3.7 | 69.19,19.61 v68.58,19
  pour Bottom: 106.36,17.46 139.7,17.46 139.7,0 106.36,0
  pour Top: 106.36,0 106.36,17.46 139.7,17.46 139.7,0
HN1  (via drill 0.25)
  Top 0.203: v62.99,39.62 59.23,43.38 v59.23,49.38
  Bottom 0.203: v62.99,39.62 65.02,39.62 66.24,38.41 IC13.8 | v59.23,49.38 59.03,49.58 44.7,49.58 43.38,50.9 IC2.9
HN2  (via drill 0.25)
  Top 0.203: v67.26,16.66 63.4,20.52 63.4,39.22 63.6,39.42 63.6,46.13 58.93,50.8 v55.27,50.8
  Bottom 0.203: v67.26,16.66 68.58,15.34 IC3.8 | v55.27,50.8 54.66,50.19 49.17,50.19 48.46,50.9 IC2.11
HN3  (via drill 0.25)
  Top 0.203: v67.06,19.1 66.75,19.41 66.75,38.41 64.01,41.15 64.01,49.38 54.86,58.52 51,58.52 IC2.13
  Bottom 0.203: v67.06,19.1 67.36,19.1 67.36,19.61 IC3.6
N$1
  Top 0.61: J2.+ 126.77,9.75 134.24,2.29 136.78,2.29 D1.A
N$2
  Bottom 0.203: R2.2 8.13,59.84 7.32,59.03 PWR.K
QCLK  (via drill 0.25)
  Top 0.203: v12.09,11.38 12.09,21.03 11.07,22.05 11.07,46.02 15.54,46.02 16.56,45.01 IC1.35
  Bottom 0.203: v12.09,11.38 15.95,7.52 J1.55
R//W  (via drill 0.25)
  Top 0.203: IC2.3 27.33,50.6 27.33,47.65 24.99,45.31 IC1.32 24.49,42.98 23.16,41.66 23.16,21.95 22.55,21.34 v22.55,8.13
  Bottom 0.203: v22.55,8.13 22.55,7.52 J1.52
SSF  (via drill 0.25)
  Top 0.203: v44.7,46.94 44.7,50.19 45.11,50.6 IC2.10
  Bottom 0.203: 65.84,41.45 65.84,41.55 65.53,41.86 65.53,42.57 IC13.6 | 65.84,41.45 65.84,40.54 65.53,40.23 61.67,40.23 61.67,38.41 IC13.12 | v44.7,46.94 45.01,46.63 52.32,46.63 57.51,41.45 65.84,41.45
VCC  (via drill 0.3)
  Top 0.61: v116.64,7.11 120.7,7.11 120.7,7.52 121.72,8.53 U1.VOUT | IC2.24 22.76,58.22 26.21,54.76 26.21,50.39 20.83,45.01 20.83,42.77 19.91,41.86 19.91,30.07 IC1.7 | v58.62,50.19 58.42,49.99 58.42,42.37 v58.22,42.16 v58.22,38.81 58.73,38.3 v58.73,16.66 58.93,16.46 58.93,11.38 v59.33,10.97 | IC4.32 72.44,39.93 72.44,42.98 IC7.1 72.44,45.31 72.44,58.22 IC7.32 | v45.52,17.07 v45.52,15.14 | v18.09,16.56 18.09,7.52 J1.7
  Bottom 0.61: U1.VOUT 122.05,9.27 120.84,10.47 C8.1 117.47,10.41 116.33,10.41 114.81,8.89 IC10.1 | v116.64,7.11 114.4,7.11 IC10.3 113.49,6.81 112.67,5.99 87.17,5.99 82.91,10.26 79.05,10.26 77.22,8.43 | 77.22,8.43 76.3,7.52 J1.31 | IC2.24 21.95,59.13 20.32,59.13 C4.2 19.41,58.62 19.2,58.62 18.19,57.61 5.79,57.61 4.88,58.52 PWR.A | C11.1 8.43,38.1 10.67,38.1 IC6.3 11.58,37.9 17.27,32.21 19.41,32.21 C3.1 19.91,31.19 19.91,30.07 IC1.7 19.91,27.74 26.21,21.44 RN1.1 | C17.1 57.61,52.32 58.62,52.32 IC5.14 58.62,50.8 v58.62,50.19 | C16.1 57.61,37.29 58.62,37.29 IC13.14 | v58.22,42.16 58.62,42.57 IC13.1 | v58.22,38.81 58.62,38.41 IC13.14 | IC13.14 58.93,36.47 59.54,35.87 63.7,35.87 63.7,36.47 IC13.10 64.21,37.49 64.92,37.49 IC13.9 65.53,36.47 65.53,35.87 67.67,35.87 70.21,38.41 C18.2 71.02,38.91 71.83,38.91 IC4.32 | C19.1 70.92,59.44 71.83,59.44 IC7.32 | C6.2 71.22,43.69 71.83,43.69 IC7.1 | C14.1 44.91,15.14 v45.52,15.14 46.13,15.14 IC8.16 | IC3.14 60.96,15.14 59.94,15.14 C15.1 59.13,15.65 58.42,16.36 | C13.1 30.58,15.14 31.8,15.14 IC9.16 | 58.42,16.36 58.01,16.76 45.92,16.76 45.62,17.07 v45.52,17.07 32,17.07 30.58,15.65 C13.1 | 18.09,16.76 22.86,16.76 25.5,19.41 RN1.1 | 18.09,16.76 8.84,16.76 6.3,14.22 C7.1 | 18.09,16.76 v18.09,16.56 | C13.1 29.67,15.65 26.11,19.2 RN1.1 | 58.42,16.36 v58.73,16.66 | v59.33,10.97 74.68,10.97 77.22,8.43
X1
  Top 0.203: IC1.39 6.71,45.31 6.6,45.41 6.6,50.29 Q1.1
  Bottom 0.203: C2.2 6.4,53.44 6.4,51.31 Q1.1
X2
  Top 0.203: IC1.38 9.75,45.31 10.87,46.43 10.87,50.29 Q1.2
  Bottom 0.203: C1.2 11.18,53.44 11.18,51.31 Q1.2

### Text on the board
bPlace: Pugputer 6309 - CPU v2